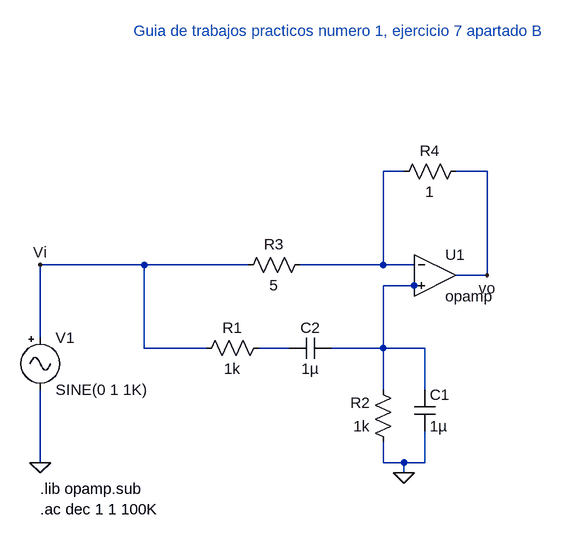
[diagram p0: schematic tp_1_7_b.asc]
tp_1_7_b.asc, the LTspice schematic file:
Version 4
SHEET 1 964 680
WIRE 576 80 544 80
WIRE 704 80 656 80
WIRE 176 224 16 224
WIRE 336 224 176 224
WIRE 544 224 544 80
WIRE 544 224 416 224
WIRE 592 224 544 224
WIRE 704 240 704 80
WIRE 704 240 656 240
WIRE 592 256 544 256
WIRE 608 256 592 256
WIRE 16 336 16 224
WIRE 176 352 176 224
WIRE 272 352 176 352
WIRE 400 352 352 352
WIRE 544 352 544 256
WIRE 544 352 464 352
WIRE 608 352 544 352
WIRE 544 416 544 352
WIRE 608 416 608 352
WIRE 16 528 16 416
WIRE 544 528 544 496
WIRE 576 528 544 528
WIRE 608 528 608 480
WIRE 608 528 576 528
WIRE 576 544 576 528
FLAG 16 528 0
FLAG 16 224 Vi
FLAG 576 544 0
FLAG 704 240 vo
SYMBOL Misc/signal 16 320 R0
SYMATTR InstName V1
SYMATTR Value2 AC 1
SYMBOL res 368 336 R90
WINDOW 0 0 56 VBottom 2
WINDOW 3 32 56 VTop 2
SYMATTR InstName R1
SYMATTR Value 1k
SYMBOL res 560 512 R180
WINDOW 0 36 76 Left 2
WINDOW 3 36 40 Left 2
SYMATTR InstName R2
SYMATTR Value 1k
SYMBOL res 432 208 R90
WINDOW 0 0 56 VBottom 2
WINDOW 3 32 56 VTop 2
SYMATTR InstName R3
SYMATTR Value 5
SYMBOL res 672 64 R90
WINDOW 0 0 56 VBottom 2
WINDOW 3 32 56 VTop 2
SYMATTR InstName R4
SYMATTR Value 1
SYMBOL cap 592 416 R0
SYMATTR InstName C1
SYMATTR Value 1µ
SYMBOL cap 464 336 R90
WINDOW 0 0 32 VBottom 2
WINDOW 3 32 32 VTop 2
SYMATTR InstName C2
SYMATTR Value 1µ
SYMBOL Opamps/opamp 624 176 R0
SYMATTR InstName U1
TEXT 16 568 Left 2 !.lib opamp.sub
TEXT 16 600 Left 2 !.ac dec 1 1 100K
TEXT 160 -136 Left 2 ;Guia de trabajos practicos numero 1, ejercicio 7 apartado B

The netlist it stands for:
* tp_1_7_b.asc
V1 Vi 0 SINE(0 1 1K) AC 1
R1 N003 Vi 1k
R2 0 N002 1k
R3 N001 Vi 5
R4 vo N001 1
C1 N002 0 1µ
C2 N002 N003 1µ
XU1 N001 N002 vo opamp Aol=100K GBW=10Meg  ; pins invin noninvin out
.lib opamp.sub
.ac dec 1 1 100K
* Guia de trabajos practicos numero 1, ejercicio 7 apartado B
.backanno
.end